# Altium schematic sheet Connectors.SchDoc
size B; SheetNumber: 4; SheetTotal: 6
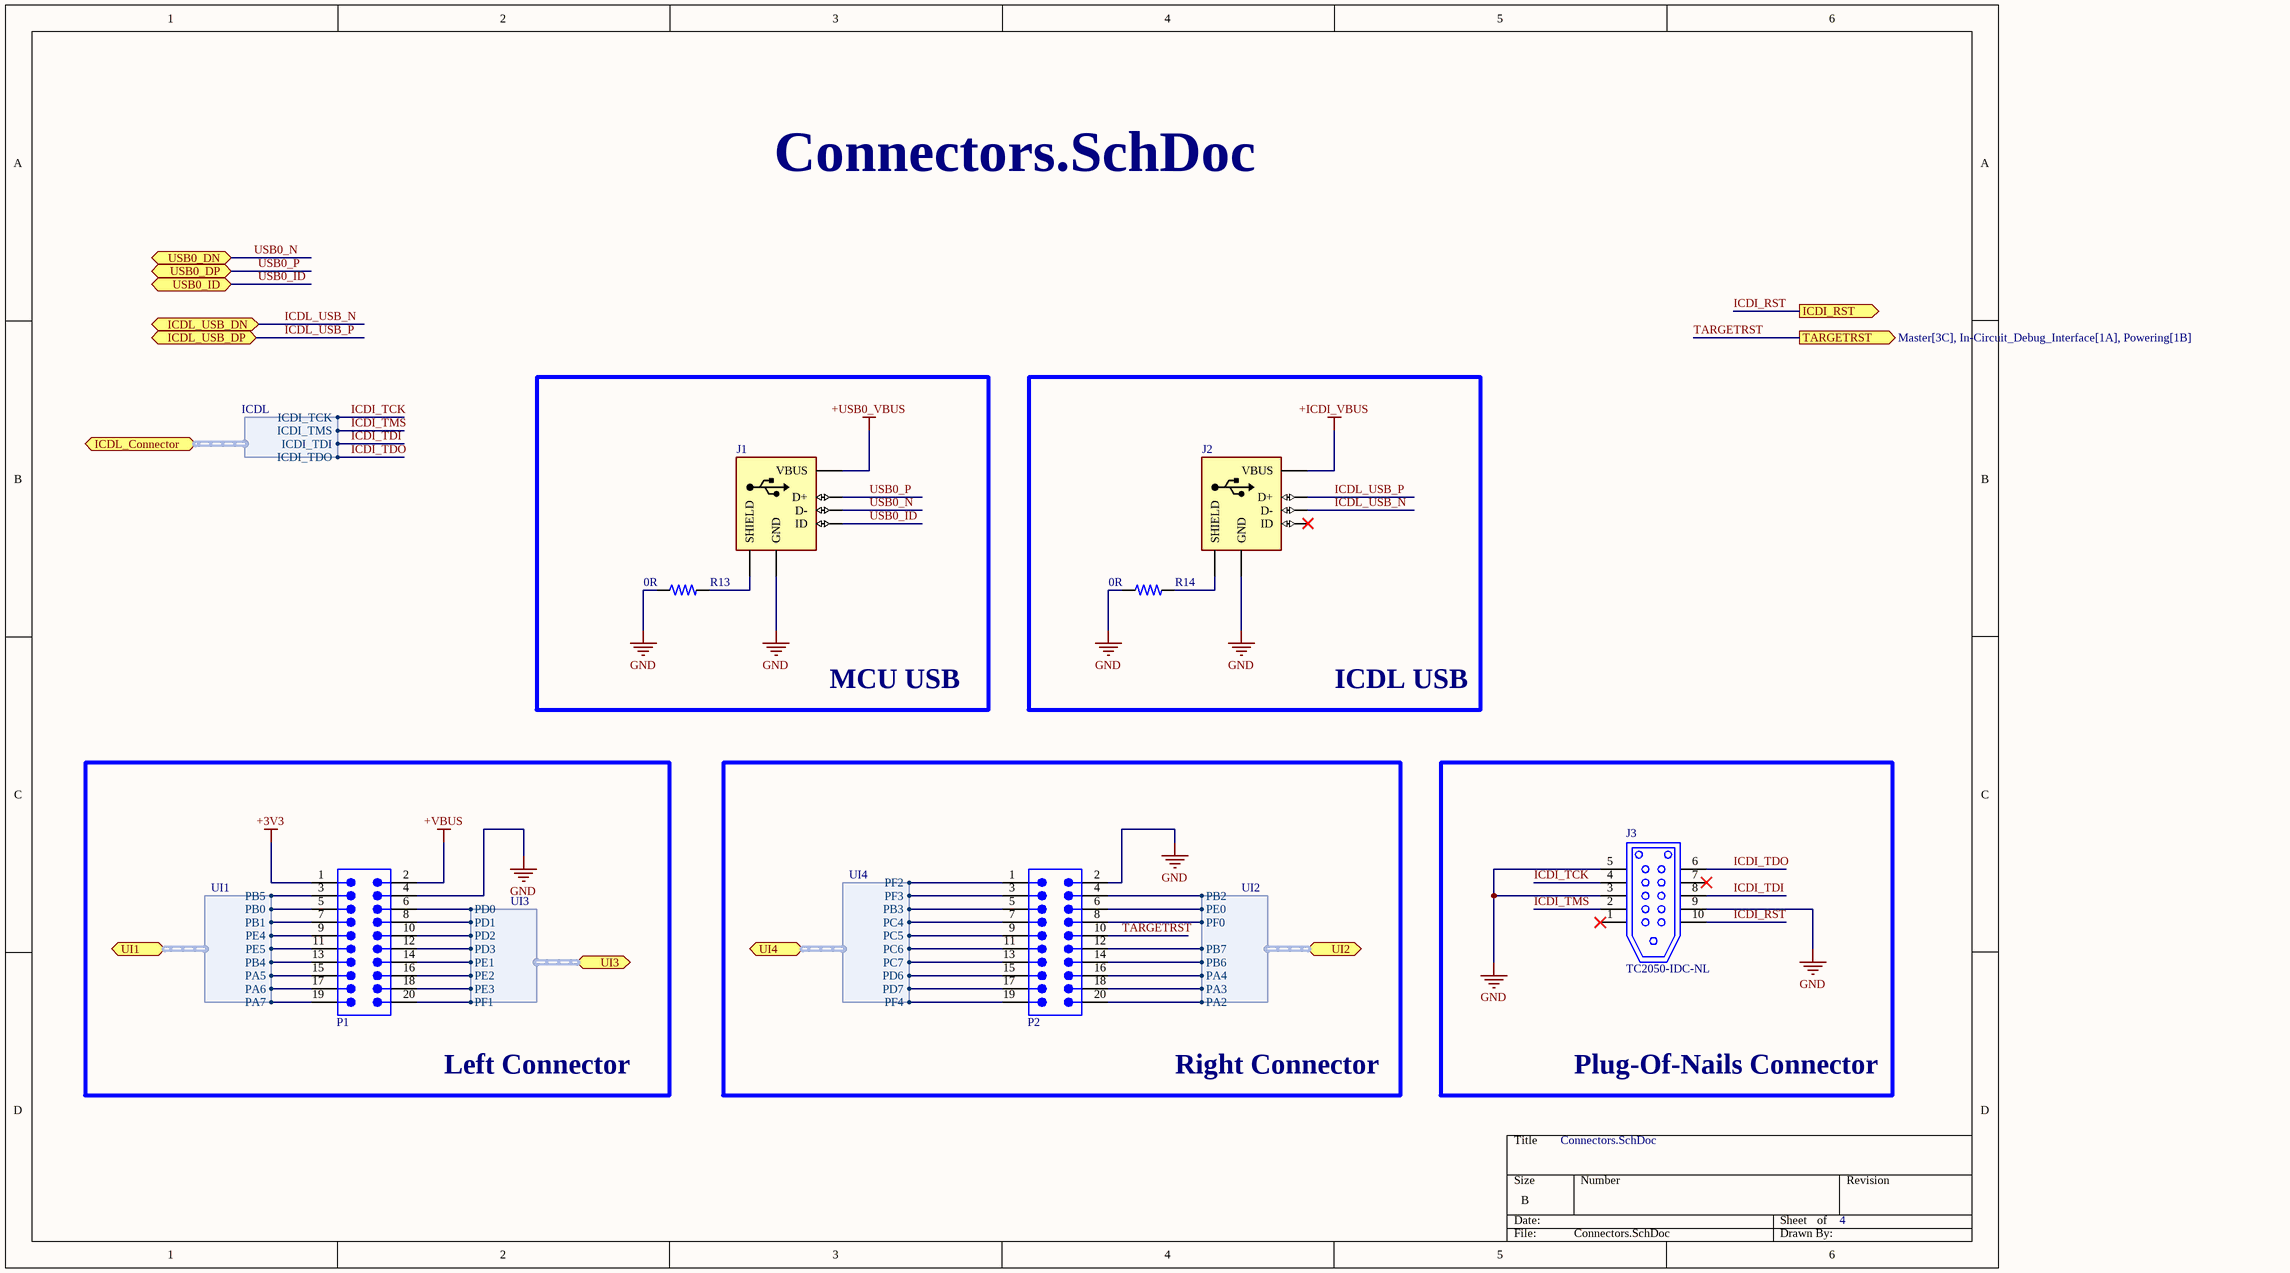
[diagram p0: Connectors.SchDoc]

## Parts
J1  USB3085-XX-X_REVD  [GCT_USB3085-XX-X_REVD]  (value not drawn)
J2  USB3085-XX-X_REVD  [GCT_USB3085-XX-X_REVD]  (value not drawn)
J3  TC2050-IDC-NL  [TAG-CONNECT_TC2050-IDC-NL]
P1  61302021121  [61302021121]  (value not drawn)
P2  61302021121  [61302021121]  (value not drawn)
R13  0R  [FP-ERA3A-IPC_B]
R14  0R  [FP-ERA3A-IPC_B]

## Blocks framed on the sheet
MCU USB: J1 R13
ICDL USB: J2 R14
Left Connector: P1
Right Connector: P2
Plug-Of-Nails Connector: J3

## Ports
ICDI_RST (out, see Master[4C], Powering[1A]), ICDL_Connector (bidir, harness ICDL, see Master[3B], In-Circuit_Debug_Interface[1C]), ICDL_USB_DN (bidir, see Master[3B], In-Circuit_Debug_Interface[1A]), ICDL_USB_DP (bidir, see Master[3B], In-Circuit_Debug_Interface[1A]), TARGETRST (out, see Master[3C], In-Circuit_Debug_Interface[1A], Powering[1B]), UI1 (bidir, harness UI1, see Master[3C], Main_MCU[1B]), UI2 (bidir, harness UI2, see Master[3C], Main_MCU[1C]), UI3 (bidir, harness UI3, see Master[3C], Main_MCU[1C]), UI4 (bidir, harness UI4, see Master[3C], Main_MCU[1D]), USB0_DN (bidir, see Master[3C], Main_MCU[4A]), USB0_DP (bidir, see Master[3C], Main_MCU[4A]), USB0_ID (bidir, see Master[3C], Main_MCU[4A])

## Harnesses
ICDL: ICDI_TCK, ICDI_TMS, ICDI_TDI, ICDI_TDO
UI1: PB5, PB0, PB1, PE4, PE5, PB4, PA5, PA6, PA7
UI2: PB2, PE0, PF0, PB7, PB6, PA4, PA3, PA2
UI3: PD0, PD1, PD2, PD3, PE1, PE2, PE3, PF1
UI4: PF2, PF3, PB3, PC4, PC5, PC6, PC7, PD6, PD7, PF4

## Nets
+3V3: P1.1
+ICDI_VBUS: J2.1(VBUS)
+USB0_VBUS: J1.1(VBUS)
+VBUS: P1.2
GND: J1.5(GND) J2.5(GND) J3.3 J3.5 J3.9 P1.4 P2.2 R13.1 R14.1
ICDI_RST: J3.10 ; port ICDI_RST
ICDI_TCK: J3.4 ; port ICDL_Connector.ICDI_TCK
ICDI_TDI: J3.8 ; port ICDL_Connector.ICDI_TDI
ICDI_TDO: J3.6 ; port ICDL_Connector.ICDI_TDO
ICDI_TMS: J3.2 ; port ICDL_Connector.ICDI_TMS
ICDL_USB_N: J2.2(D-) ; port ICDL_USB_DN
ICDL_USB_P: J2.3(D+) ; port ICDL_USB_DP
TARGETRST: P2.10 ; port TARGETRST
USB0_ID: J1.4(ID) ; port USB0_ID
USB0_N: J1.2(D-) ; port USB0_DN
USB0_P: J1.3(D+) ; port USB0_DP
NetJ1_SH: J1.SH(SHIELD) R13.2
NetJ2_SH: J2.SH(SHIELD) R14.2
NetP1_3: P1.3 ; port UI1.PB5
NetP1_5: P1.5 ; port UI1.PB0
NetP1_6: P1.6 ; port UI3.PD0
NetP1_7: P1.7 ; port UI1.PB1
NetP1_8: P1.8 ; port UI3.PD1
NetP1_9: P1.9 ; port UI1.PE4
NetP1_10: P1.10 ; port UI3.PD2
NetP1_11: P1.11 ; port UI1.PE5
NetP1_12: P1.12 ; port UI3.PD3
NetP1_13: P1.13 ; port UI1.PB4
NetP1_14: P1.14 ; port UI3.PE1
NetP1_15: P1.15 ; port UI1.PA5
NetP1_16: P1.16 ; port UI3.PE2
NetP1_17: P1.17 ; port UI1.PA6
NetP1_18: P1.18 ; port UI3.PE3
NetP1_19: P1.19 ; port UI1.PA7
NetP1_20: P1.20 ; port UI3.PF1
NetP2_1: P2.1 ; port UI4.PF2
NetP2_3: P2.3 ; port UI4.PF3
NetP2_4: P2.4 ; port UI2.PB2
NetP2_5: P2.5 ; port UI4.PB3
NetP2_6: P2.6 ; port UI2.PE0
NetP2_7: P2.7 ; port UI4.PC4
NetP2_8: P2.8 ; port UI2.PF0
NetP2_9: P2.9 ; port UI4.PC5
NetP2_11: P2.11 ; port UI4.PC6
NetP2_12: P2.12 ; port UI2.PB7
NetP2_13: P2.13 ; port UI4.PC7
NetP2_14: P2.14 ; port UI2.PB6
NetP2_15: P2.15 ; port UI4.PD6
NetP2_16: P2.16 ; port UI2.PA4
NetP2_17: P2.17 ; port UI4.PD7
NetP2_18: P2.18 ; port UI2.PA3
NetP2_19: P2.19 ; port UI4.PF4
NetP2_20: P2.20 ; port UI2.PA2

Not connected (* = marked no-connect by the designer): J2 4(ID)*; J3 1* 7*

## Library data of the parts
J1 J2 = USB3085-XX-X_REVD: USB - micro AB USB 2.0 Receptacle Connector 5 Position Surface Mount, Right Angle; pin to pad: SH>6+7+8+9; MF: Global Connector Technology; MP: USB3085-30-A; SnapEDA_Link: https://www.snapeda.com/parts/USB3085-30-A/Global%20Connector%20Technology/view-part/446505/?ref=snap; Price: None; Value: *; Availability: Unavailable; Package: None
J3 = TC2050-IDC-NL: MSP-FET430 Flash Emulation Tool Plug-Of-Nailsâ„¢ Adapter Cable; MF: Tag-Connect LLC; Price: None; Availability: In Stock; MP: TC2050-IDC-NL; Package: None; SnapEDA_Link: https://www.snapeda.com/parts/TC2050-IDC-NL/Tag-Connect+LLC/view-part/?ref=snap; Check_prices: https://www.snapeda.com/parts/TC2050-IDC-NL/Tag-Connect+LLC/view-part/?ref=eda; Value: *; Purchase-URL: https://pricing.snapeda.com/search/part/TC2050-IDC-NL/?ref=eda
P1 P2 = 61302021121: WR-PHD Pin Header, THT, Vertical, pitch 2.54mm, 2 Row, 20P; Manufacturer: Wurth Elektronik; Contact Resistance: 20mOhm; Rated Current: 3A; Working Voltage: 250V; Withstanding Voltage: 500V; Manufacturer Part Number: 61302021121; Category: Board-to-Board Connectors; Match Code: WR-PHD; ComponentLink1Description: Website Link; ComponentLink1URL: https://www.we-online.com/redexpert/article/61302021121?ad; ComponentLink2Description: Datasheet Link; ComponentLink2URL: https://www.we-online.com/redexpert/spec/61302021121?ad; Mount: Through Hole; Operating Temperature Max: 105°C; Operating Temperature Min: -40°C; Packaging: Bag; Gender: Pin Header; Number of Pins: 20; Number of Rows: 2; Orientation: Vertical; Pitch: 2.54mm
R13 R14 = 0603 SMD RES: Fixed Resistor, Metal Glaze/thick Film, 0.1W, 0ohm, Surface Mount, 0603; Manufacturer: Panasonic; Manufacturer Part Number: ERJ-3GEY0R00V; Power: 100mW; Rated Temperature: 70°C; Package Height: 0.45mm; Package Length: 1.6mm; Package Width: 0.8mm; Reference Standard: AEC-Q200; Supplier: Mouser; Supplier Part Number: 667-ERJ-3GEY0R00V; RoHS: Yes; Category: Chip SMD Resistors; Stock: 3258844; Pricing: 1=0.1, 10=0.022, 50=0.022, 100=0.01, 1000=0.008, 10000=0.004 (USD); Mounting Technology: Surface Mount; Pins: 2; Package Shape: Rectangular; Case/Package: 0603; Terminal Finish: Nickel; Min Operating Temperature: -55°C; Max Operating Temperature: 155°C; JESD-609 Code: e3; Resistor Type: FIXED RESISTOR; Construction: Rectangular; Packaging: Tape and Reel; Value: 0R; Technology: METAL GLAZE/THICK FILM; Termination: Wraparound; Reach SVHC Compliant: Yes; RoHS Compliant: Yes; ComponentLink1URL: https://datasheet.ciiva.com:443/pdfs/VipMasterIC/IC/PANA/PANA-S-A0009459603/PANA-S-A0009459603-1.pdf?src-supplier=IHS+Markit; ComponentLink1Description: https://datasheet.ciiva.com:443/pdfs/VipMasterIC/IC/PANA/PANA-S-A0009459603/PANA-S-A0009459603-1.pdf?src-supplier=IHS+Markit; ComponentLink2URL: https://datasheet.ciiva.com/27055/1935748-27055113.pdf?src-supplier=Jameco; ComponentLink2Description: https://datasheet.ciiva.com/27055/1935748-27055113.pdf?src-supplier=Jameco; ComponentLink3URL: https://datasheet.ciiva.com/11808/0900766b80f806dd-11808207.pdf?src-supplier=Rs; ComponentLink3Description: https://datasheet.ciiva.com/11808/0900766b80f806dd-11808207.pdf?src-supplier=Rs; ComponentLink4URL: https://datasheet.ciiva.com/46377/1678796-46377868.pdf?src-supplier=Element14; ComponentLink4Description: https://datasheet.ciiva.com/46377/1678796-46377868.pdf?src-supplier=Element14; ComponentLink5URL: https://datasheet.ciiva.com/9198/aoa0000ce1-9198975.pdf?src-supplier=Avnet; ComponentLink5Description: https://datasheet.ciiva.com/9198/aoa0000ce1-9198975.pdf?src-supplier=Avnet; ComponentLink6URL: https://datasheet.ciiva.com/16834/aoa0000ce1-16834828.pdf?src-supplier=Future+Electronics; ComponentLink6Description: https://datasheet.ciiva.com/16834/aoa0000ce1-16834828.pdf?src-supplier=Future+Electronics; ComponentLink7URL: https://datasheet.ciiva.com/30199/4aoa0000ce1-30199822.pdf?src-supplier=Onlinecomponents.com; ComponentLink7Description: https://datasheet.ciiva.com/30199/4aoa0000ce1-30199822.pdf?src-supplier=Onlinecomponents.com; ComponentLink8URL: https://datasheet.ciiva.com/43460/1678796-43460647.pdf?src-supplier=Farnell; ComponentLink8Description: https://datasheet.ciiva.com/43460/1678796-43460647.pdf?src-supplier=Farnell; ComponentLink9URL: https://datasheet.ciiva.com/5959/1678796-5959707.pdf?src-supplier=Farnell; ComponentLink9Description: https://datasheet.ciiva.com/5959/1678796-5959707.pdf?src-supplier=Farnell; ComponentLink10URL: https://datasheet.ciiva.com/28695/1678796-28695833.pdf?src-supplier=Element14; ComponentLink10Description: https://datasheet.ciiva.com/28695/1678796-28695833.pdf?src-supplier=Element14; ComponentLink11URL: https://datasheet.ciiva.com/16758/70255313-16758527.pdf?src-supplier=Allied+Electronics; ComponentLink11Description: https://datasheet.ciiva.com/16758/70255313-16758527.pdf?src-supplier=Allied+Electronics; ComponentLink12URL: https://datasheet.ciiva.com/48532/aoa0000ce1-48532165.pdf?src-supplier=Avnet; ComponentLink12Description: https://datasheet.ciiva.com/48532/aoa0000ce1-48532165.pdf?src-supplier=Avnet